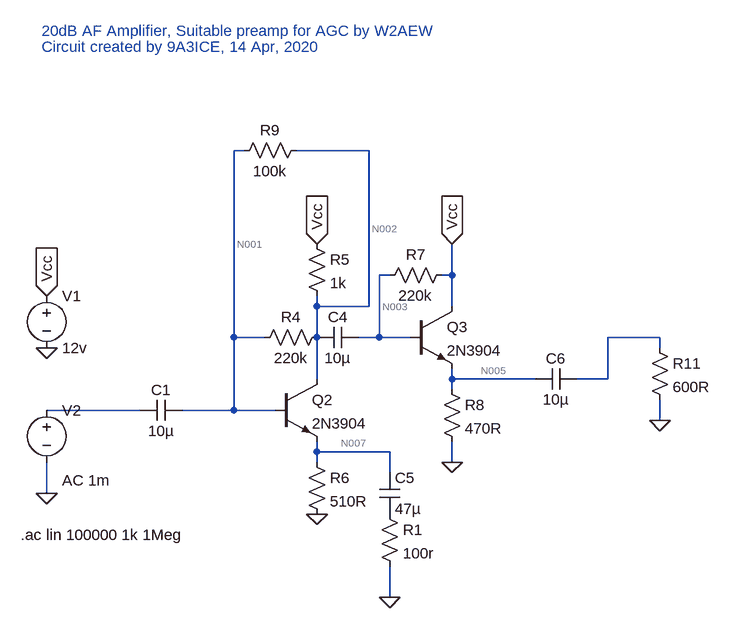
[diagram p0: schematic IF_AF_PA.asc]
IF_AF_PA.asc, the LTspice schematic file:
Version 4
SHEET 1 928 680
WIRE -752 -400 -768 -400
WIRE -560 -400 -672 -400
WIRE -528 -208 -544 -208
WIRE -432 -208 -432 -256
WIRE -432 -208 -448 -208
WIRE -640 -160 -640 -176
WIRE -560 -160 -560 -400
WIRE -560 -160 -640 -160
WIRE -432 -160 -432 -208
WIRE -768 -112 -768 -400
WIRE -720 -112 -768 -112
WIRE -640 -112 -640 -160
WIRE -544 -112 -544 -208
WIRE -544 -112 -576 -112
WIRE -496 -112 -544 -112
WIRE -112 -112 -192 -112
WIRE -112 -96 -112 -112
WIRE -640 -48 -640 -112
WIRE -432 -48 -432 -64
WIRE -304 -48 -432 -48
WIRE -192 -48 -192 -112
WIRE -192 -48 -240 -48
WIRE -432 -32 -432 -48
WIRE -912 0 -1056 0
WIRE -768 0 -768 -112
WIRE -768 0 -848 0
WIRE -704 0 -768 0
WIRE -112 16 -112 -16
WIRE -640 64 -640 48
WIRE -528 64 -640 64
WIRE -640 80 -640 64
WIRE -432 80 -432 48
WIRE -528 96 -528 64
WIRE -1056 128 -1056 80
WIRE -528 288 -528 240
FLAG -640 -256 Vcc
IOPIN -640 -256 In
FLAG -640 160 0
FLAG -432 -256 Vcc
IOPIN -432 -256 In
FLAG -432 80 0
FLAG -1056 -96 0
FLAG -1056 -176 Vcc
IOPIN -1056 -176 In
FLAG -1056 128 0
FLAG -112 16 0
FLAG -528 288 0
SYMBOL cap -848 -16 R90
WINDOW 0 0 32 VBottom 2
WINDOW 3 32 32 VTop 2
SYMATTR InstName C1
SYMATTR Value 10µ
SYMBOL npn -704 -48 R0
SYMATTR InstName Q2
SYMATTR Value 2N3904
SYMBOL res -624 -128 R90
WINDOW 0 0 56 VBottom 2
WINDOW 3 32 56 VTop 2
SYMATTR InstName R4
SYMATTR Value 220k
SYMBOL res -656 -272 R0
SYMATTR InstName R5
SYMATTR Value 1k
SYMBOL cap -576 -128 R90
WINDOW 0 0 32 VBottom 2
WINDOW 3 32 32 VTop 2
SYMATTR InstName C4
SYMATTR Value 10µ
SYMBOL res -656 64 R0
SYMATTR InstName R6
SYMATTR Value 510R
SYMBOL cap -544 96 R0
SYMATTR InstName C5
SYMATTR Value 47µ
SYMBOL npn -496 -160 R0
SYMATTR InstName Q3
SYMATTR Value 2N3904
SYMBOL res -432 -224 R90
WINDOW 0 0 56 VBottom 2
WINDOW 3 32 56 VTop 2
SYMATTR InstName R7
SYMATTR Value 220k
SYMBOL res -448 -48 R0
SYMATTR InstName R8
SYMATTR Value 470R
SYMBOL res -656 -416 R90
WINDOW 0 0 56 VBottom 2
WINDOW 3 32 56 VTop 2
SYMATTR InstName R9
SYMATTR Value 100k
SYMBOL voltage -1056 -192 R0
WINDOW 123 0 0 Left 0
WINDOW 39 0 0 Left 0
SYMATTR InstName V1
SYMATTR Value 12v
SYMBOL voltage -1056 -16 R0
WINDOW 123 24 124 Left 2
WINDOW 39 0 0 Left 0
SYMATTR Value2 AC 1m
SYMATTR InstName V2
SYMATTR Value ""
SYMBOL res -128 -112 R0
SYMATTR InstName R11
SYMATTR Value 600R
SYMBOL cap -240 -64 R90
WINDOW 0 0 32 VBottom 2
WINDOW 3 32 32 VTop 2
SYMATTR InstName C6
SYMATTR Value 10µ
SYMBOL res -544 144 R0
SYMATTR InstName R1
SYMATTR Value 100r
TEXT -1064 -584 Left 2 ;20dB AF Amplifier, Suitable preamp for AGC by W2AEW
TEXT -1064 -560 Left 2 ;Circuit created by 9A3ICE, 14 Apr, 2020
TEXT -1096 192 Left 2 !.ac lin 100000 1k 1Meg

The netlist it stands for:
* IF_AF_PA.asc
C1 N001 N006 10µ
Q2 N002 N001 N007 0 2N3904
R4 N002 N001 220k
R5 Vcc N002 1k
C4 N003 N002 10µ
R6 N007 0 510R
C5 N007 P001 47µ
Q3 Vcc N003 N005 0 2N3904
R7 Vcc N003 220k
R8 N005 0 470R
R9 N002 N001 100k
V1 Vcc 0 12v
V2 N006 0 AC 1m
R11 N004 0 600R
C6 N004 N005 10µ
R1 P001 0 100r
.model NPN NPN
.model PNP PNP
.lib standard.bjt
* 20dB AF Amplifier, Suitable preamp for AGC by W2AEW
* Circuit created by 9A3ICE, 14 Apr, 2020
.ac lin 100000 1k 1Meg
.backanno
.end

* Results of the author's LTspice run, read from the files saved beside the schematic
* Operating Point, zero values left out:
*   V(n001) = 4.018 V
*   V(n002) = 5.503 V
*   V(n007) = 3.313 V
*   V(vcc) = 12 V
*   V(n003) = 5.247 V
*   V(n005) = 4.533 V
*   Ic(Q3) = 9.614 mA
*   Ib(Q3) = 30.7 µA
*   Ie(Q3) = -9.645 mA
*   Ic(Q2) = 6.475 mA
*   Ib(Q2) = 21.61 µA
*   Ie(Q2) = -6.497 mA
*   I(R9) = 14.85 µA
*   I(R8) = 9.645 mA
*   I(R7) = 30.7 µA
*   I(R6) = 6.497 mA
*   I(R5) = 6.497 mA
*   I(R4) = 6.752 µA
*   I(V1) = -16.14 mA